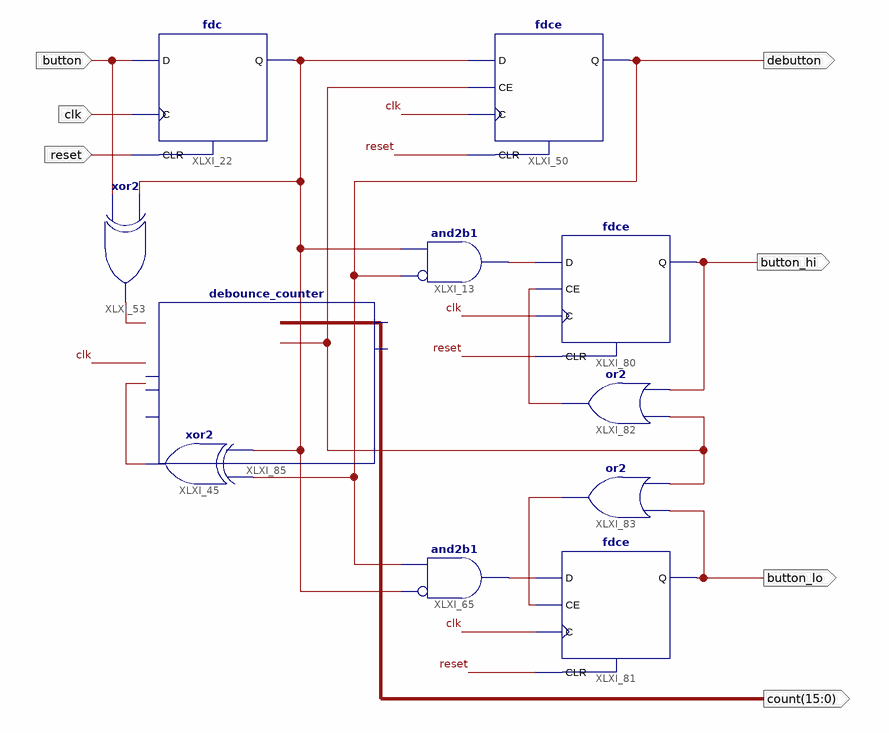
[diagram p0: schematic sheet 1]
// Xilinx ISE schematic debouncer.sch (spartan3e) as structural Verilog: 11 symbols, 7 ports
module debouncer (
  input  clk,
  input  reset,
  input  button,
  output [15:0] count,
  output debutton,
  output button_lo,
  output button_hi
);

  wire XLXN_101, XLXN_152, XLXN_205, XLXN_219, XLXN_251, XLXN_265, XLXN_266, XLXN_268;

  fdc XLXI_22 (.C(clk), .CLR(reset), .D(button), .Q(XLXN_219));
  xor XLXI_45 (XLXN_101, XLXN_219, debutton);
  fdce XLXI_50 (.C(clk), .CE(XLXN_268), .CLR(reset), .D(XLXN_219), .Q(debutton));
  xor XLXI_53 (XLXN_152, button, XLXN_219);
  fdce XLXI_81 (.C(clk), .CE(XLXN_266), .CLR(reset), .D(XLXN_251), .Q(button_lo));
  and XLXI_65 (XLXN_251, ~XLXN_219, debutton);  // and2b1
  or XLXI_83 (XLXN_266, XLXN_268, button_lo);
  or XLXI_82 (XLXN_265, button_hi, XLXN_268);
  fdce XLXI_80 (.C(clk), .CE(XLXN_265), .CLR(reset), .D(XLXN_205), .Q(button_hi));
  and XLXI_13 (XLXN_205, ~debutton, XLXN_219);  // and2b1
  debounce_counter XLXI_85 (.clk(clk), .ce(XLXN_101), .sclr(XLXN_152), .thresh0(XLXN_268), .q(count));
endmodule
